# Altium schematic sheet Sheet3.SchDoc
size A4
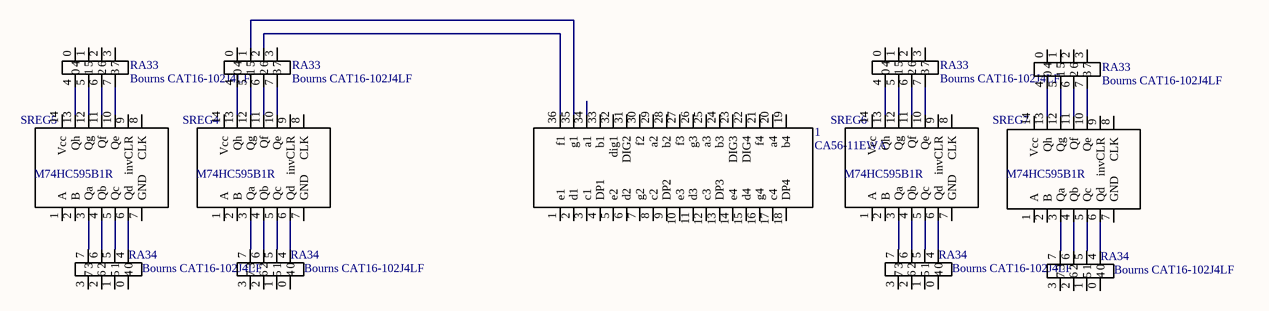
[diagram p0: Sheet3.SchDoc]

## Parts
(Parts that share a designator on the sheet are numbered #1, #2 ... from top to bottom, then left to right.)
1  CA56-11EWA  [CA56-11EWA]
RA33#1  Bourns CAT16-102J4LF  [CAT16-102J4LF]
RA33#2  Bourns CAT16-102J4LF  [CAT16-102J4LF]
RA33#3  Bourns CAT16-102J4LF  [CAT16-102J4LF]
RA33#4  Bourns CAT16-102J4LF  [CAT16-102J4LF]
RA34#1  Bourns CAT16-102J4LF  [CAT16-102J4LF]
RA34#2  Bourns CAT16-102J4LF  [CAT16-102J4LF]
RA34#3  Bourns CAT16-102J4LF  [CAT16-102J4LF]
RA34#4  Bourns CAT16-102J4LF  [CAT16-102J4LF]
SREG4  M74HC595B1R  [SN74HC164DR-D]
SREG5  M74HC595B1R  [SN74HC164DR-D]
SREG6  M74HC595B1R  [SN74HC164DR-D]
SREG7  M74HC595B1R  [SN74HC164DR-D]

## Nets
Net1_35: 1.35(g1) RA33#2.1
Net1_36: 1.36(f1) RA33#2.2
NetRA33#1_4: RA33#1.4 SREG5.13(Qh)
NetRA33#1_5: RA33#1.5 SREG5.12(Qg)
NetRA33#1_6: RA33#1.6 SREG5.11(Qf)
NetRA33#1_7: RA33#1.7 SREG5.10(Qe)
NetRA33#2_4: RA33#2.4 SREG4.13(Qh)
NetRA33#2_5: RA33#2.5 SREG4.12(Qg)
NetRA33#2_6: RA33#2.6 SREG4.11(Qf)
NetRA33#2_7: RA33#2.7 SREG4.10(Qe)
NetRA33#3_4: RA33#3.4 SREG6.13(Qh)
NetRA33#3_5: RA33#3.5 SREG6.12(Qg)
NetRA33#3_6: RA33#3.6 SREG6.11(Qf)
NetRA33#3_7: RA33#3.7 SREG6.10(Qe)
NetRA33#4_4: RA33#4.4 SREG7.13(Qh)
NetRA33#4_5: RA33#4.5 SREG7.12(Qg)
NetRA33#4_6: RA33#4.6 SREG7.11(Qf)
NetRA33#4_7: RA33#4.7 SREG7.10(Qe)
NetRA34#1_4: RA34#1.4 SREG5.6(Qd)
NetRA34#1_5: RA34#1.5 SREG5.5(Qc)
NetRA34#1_6: RA34#1.6 SREG5.4(Qb)
NetRA34#1_7: RA34#1.7 SREG5.3(Qa)
NetRA34#2_4: RA34#2.4 SREG4.6(Qd)
NetRA34#2_5: RA34#2.5 SREG4.5(Qc)
NetRA34#2_6: RA34#2.6 SREG4.4(Qb)
NetRA34#2_7: RA34#2.7 SREG4.3(Qa)
NetRA34#3_4: RA34#3.4 SREG6.6(Qd)
NetRA34#3_5: RA34#3.5 SREG6.5(Qc)
NetRA34#3_6: RA34#3.6 SREG6.4(Qb)
NetRA34#3_7: RA34#3.7 SREG6.3(Qa)
NetRA34#4_4: RA34#4.4 SREG7.6(Qd)
NetRA34#4_5: RA34#4.5 SREG7.5(Qc)
NetRA34#4_6: RA34#4.6 SREG7.4(Qb)
NetRA34#4_7: RA34#4.7 SREG7.3(Qa)

Not connected (* = marked no-connect by the designer): 1 1(e1) 2(d1) 3(c1) 4(DP1) 5(e2) 6(d2) 7(g2) 8(c2) 9(DP2) 10(e3) 11(d3) 12(c3) 13(DP3) 14(e4) 15(d4) 16(g4) 17(c4) 18(DP4) 19(b4) 20(a4) 21(f4) 22(DIG4) 23(DIG3) 24(b3) 25(a3) 26(g3) 27(f3) 28(b2) 29(a2) 30(f2) 31(DIG2) 32(dig1) 33(b1) 34(a1); RA33#1 0 1 2 3; RA33#2 0 3; RA33#3 0 1 2 3; RA33#4 0 1 2 3; RA34#1 0 1 2 3; RA34#2 0 1 2 3; RA34#3 0 1 2 3; RA34#4 0 1 2 3; SREG4 1(A) 2(B) 7(GND) 8(CLK) 9(invCLR) 14(Vcc); SREG5 1(A) 2(B) 7(GND) 8(CLK) 9(invCLR) 14(Vcc); SREG6 1(A) 2(B) 7(GND) 8(CLK) 9(invCLR) 14(Vcc); SREG7 1(A) 2(B) 7(GND) 8(CLK) 9(invCLR) 14(Vcc)